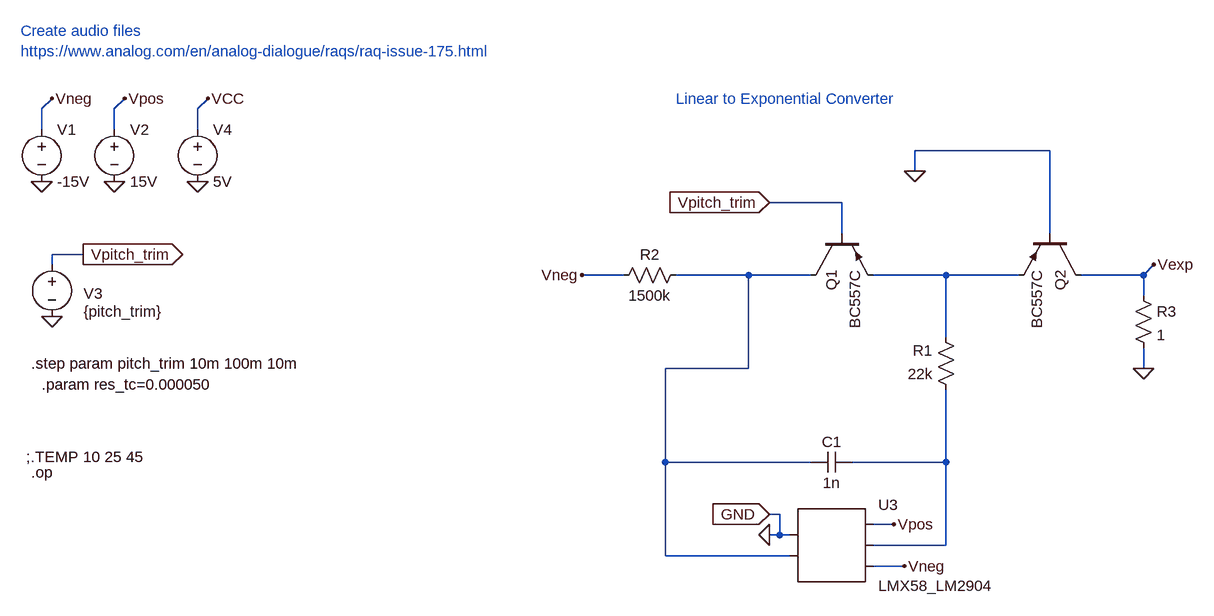
[diagram p0: schematic main_pnpbased_old.asc]
main_pnpbased_old.asc, the LTspice schematic file:
Version 4
SHEET 1 2332 952
WIRE -1504 -208 -1488 -224
WIRE -1392 -208 -1376 -224
WIRE -1264 -208 -1248 -224
WIRE -1504 -176 -1504 -208
WIRE -1392 -176 -1392 -208
WIRE -1264 -176 -1264 -208
WIRE 48 -144 -160 -144
WIRE -160 -112 -160 -144
WIRE -272 -64 -384 -64
WIRE -272 -16 -272 -64
WIRE 48 -16 48 -144
WIRE -1440 16 -1488 16
WIRE -1488 32 -1488 16
WIRE -608 48 -672 48
WIRE -416 48 -528 48
WIRE -320 48 -416 48
WIRE -112 48 -224 48
WIRE 0 48 -112 48
WIRE 192 48 208 32
WIRE 192 48 96 48
WIRE 192 80 192 48
WIRE -112 144 -112 48
WIRE -416 192 -416 48
WIRE -416 192 -544 192
WIRE 192 192 192 160
WIRE -544 336 -544 192
WIRE -320 336 -544 336
WIRE -112 336 -112 224
WIRE -112 336 -256 336
WIRE -368 416 -384 416
WIRE -192 432 -224 432
WIRE -368 448 -368 416
WIRE -368 448 -384 448
WIRE -352 448 -368 448
WIRE -112 464 -112 336
WIRE -112 464 -224 464
WIRE -544 480 -544 336
WIRE -352 480 -544 480
WIRE -176 496 -224 496
FLAG -1504 -96 0
FLAG -1392 -96 0
FLAG -1488 112 0
FLAG -1488 -224 Vneg
FLAG -1376 -224 Vpos
FLAG -1264 -96 0
FLAG -1248 -224 VCC
FLAG -1440 16 Vpitch_trim
IOPIN -1440 16 Out
FLAG -160 -112 0
FLAG 208 32 Vexp
FLAG -672 48 Vneg
FLAG -384 -64 Vpitch_trim
IOPIN -384 -64 In
FLAG -384 416 GND
IOPIN -384 416 In
FLAG -384 448 0
FLAG -176 496 Vneg
FLAG -192 432 Vpos
FLAG 192 192 0
SYMBOL pnp -320 -16 M90
SYMATTR InstName Q1
SYMATTR Value BC557C
SYMBOL pnp 96 -16 R90
SYMATTR InstName Q2
SYMATTR Value BC557C
SYMBOL res -512 32 R90
WINDOW 0 0 56 VBottom 2
WINDOW 3 32 56 VTop 2
SYMATTR InstName R2
SYMATTR Value 1500k
SYMBOL voltage -1504 -192 R0
WINDOW 123 0 0 Left 0
WINDOW 39 0 0 Left 0
SYMATTR InstName V1
SYMATTR Value -15V
SYMBOL voltage -1392 -192 R0
WINDOW 123 0 0 Left 0
WINDOW 39 0 0 Left 0
SYMATTR InstName V2
SYMATTR Value 15V
SYMBOL voltage -1488 16 R0
WINDOW 0 49 60 Left 2
WINDOW 3 49 88 Left 2
WINDOW 123 0 0 Left 0
WINDOW 39 0 0 Left 0
SYMATTR InstName V3
SYMATTR Value {pitch_trim}
SYMBOL voltage -1264 -192 R0
WINDOW 123 0 0 Left 0
WINDOW 39 0 0 Left 0
SYMATTR InstName V4
SYMATTR Value 5V
SYMBOL AutoGenerated\\LMX58_LM2904 -288 464 R0
SYMATTR InstName U3
SYMBOL res -96 240 R180
WINDOW 0 36 76 Left 2
WINDOW 3 36 40 Left 2
SYMATTR InstName R1
SYMATTR Value 22k
SYMBOL cap -256 320 R90
WINDOW 0 0 32 VBottom 2
WINDOW 3 32 32 VTop 2
SYMATTR InstName C1
SYMATTR Value 1n
SYMBOL res 176 64 R0
SYMATTR InstName R3
SYMATTR Value 1
TEXT -528 -224 Left 2 ;Linear to Exponential Converter
TEXT -1536 -328 Left 2 ;Create audio files\nhttps://www.analog.com/en/analog-dialogue/raqs/raq-issue-175.html
TEXT -1520 184 Left 2 !.step param pitch_trim 10m 100m 10m
TEXT -1528 328 Left 2 !;.TEMP 10 25 45
TEXT -1504 216 Left 2 !.param res_tc=0.000050
TEXT -1520 352 Left 2 !.op

The netlist it stands for:
* main_pnpbased_old.asc
Q1 N001 Vpitch_trim N002 0 BC557C
Q2 Vexp 0 N002 0 BC557C
R2 N001 Vneg 1500k
V1 Vneg 0 -15V
V2 Vpos 0 15V
V3 Vpitch_trim 0 {pitch_trim}
V4 VCC 0 5V
* U3: LMX58_LM2904 (symbol AutoGenerated\LMX58_LM2904 not available, pins judged from their places): pin1=0 pin2=N001 pin3=Vpos pin4=N003 pin5=Vneg
R1 N003 N002 22k
C1 N003 N001 1n
R3 Vexp 0 1
.model NPN NPN
.model PNP PNP
.lib standard.bjt
* Linear to Exponential Converter
* Create audio files
* https://www.analog.com/en/analog-dialogue/raqs/raq-issue-175.html
.step param pitch_trim 10m 100m 10m
;.TEMP 10 25 45
.param res_tc=0.000050
.op
.backanno
.end